# Altium schematic sheet k26_baseboard_dp.SchDoc: k26 Baseboard Displayport
size A4; DrawnBy: Ch. Vogt; Organization: PBL; DocumentNumber: 1; Revision: r5; SheetNumber: 12
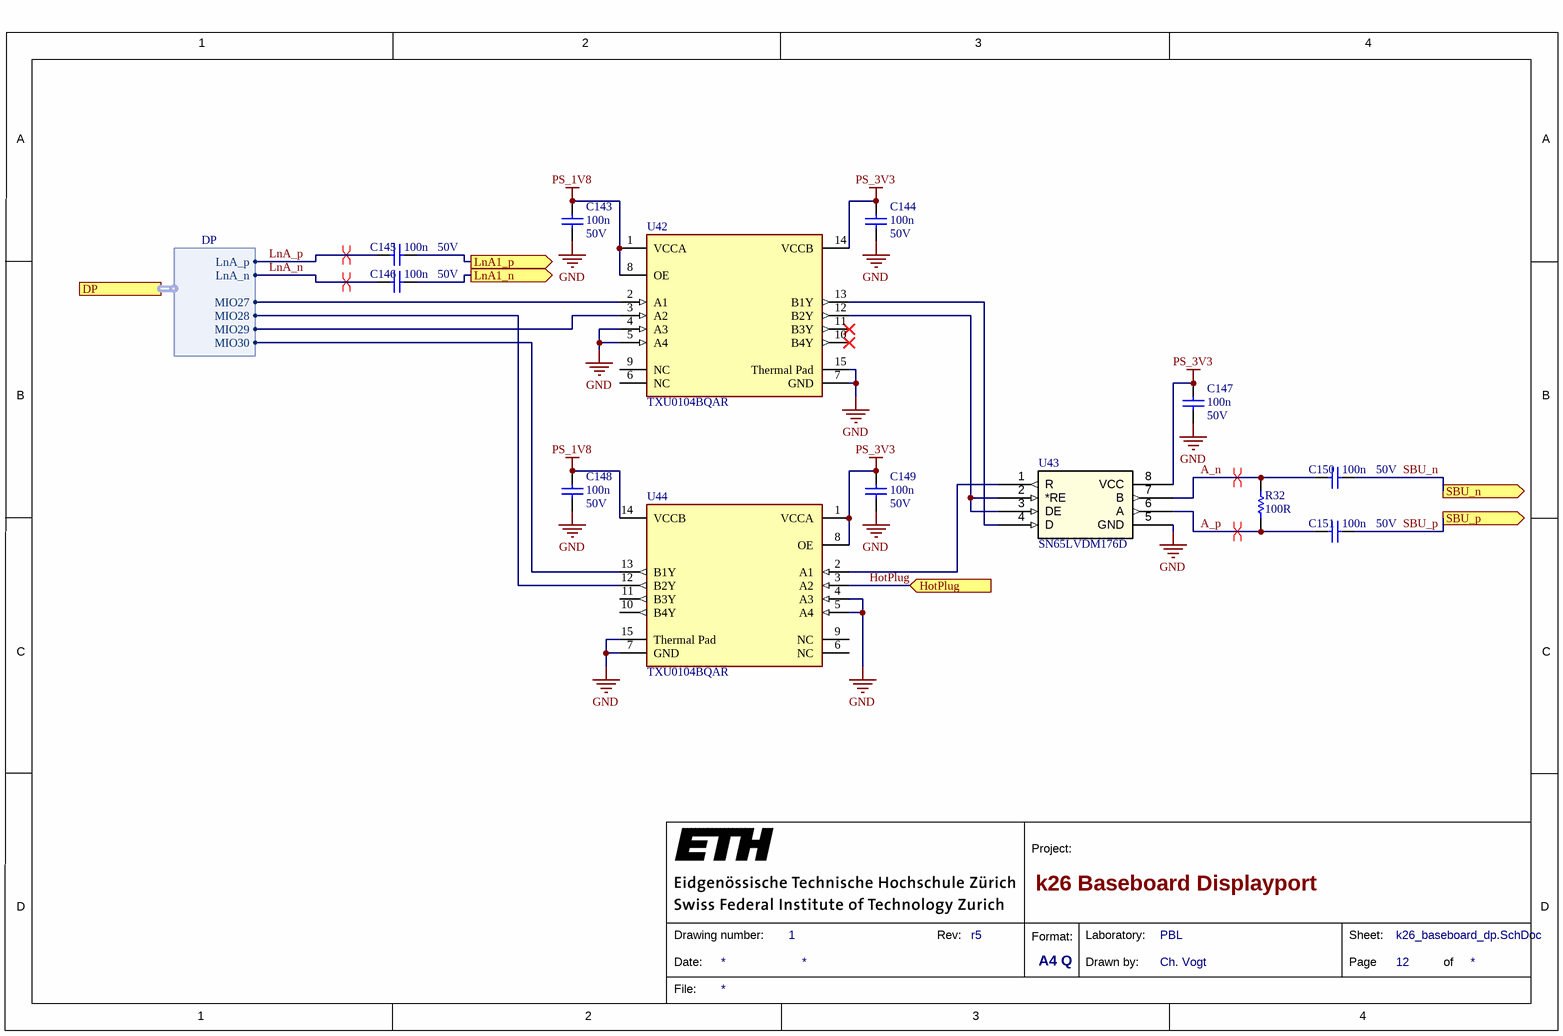
[diagram p0: k26_baseboard_dp.SchDoc]

## Parts
C143  100n  Rated DC Voltage (URdc): 50V  [CAPC0402]
C144  100n  Rated DC Voltage (URdc): 50V  [CAPC0402]
C145  100n  Rated DC Voltage (URdc): 50V  [CAPC0402]
C146  100n  Rated DC Voltage (URdc): 50V  [CAPC0402]
C147  100n  Rated DC Voltage (URdc): 50V  [CAPC0402]
C148  100n  Rated DC Voltage (URdc): 50V  [CAPC0402]
C149  100n  Rated DC Voltage (URdc): 50V  [CAPC0402]
C150  100n  Rated DC Voltage (URdc): 50V  [CAPC0402]
C151  100n  Rated DC Voltage (URdc): 50V  [CAPC0402]
R32  100R  [RES0402]
U42  TXU0104BQAR  [FP-BQA0014A-MFG]
U43  SN65LVDM176D  [D8]
U44  TXU0104BQAR  [FP-BQA0014A-MFG]

## Ports
DP (harness DP), HotPlug (in), LnA1_n (out), LnA1_p (out), SBU_n (out), SBU_p (out)

## Harnesses
DP: LnA_p, LnA_n, MIO27, MIO28, MIO29, MIO30

## Nets
GND: C143.1 C144.1 C147.1 C148.1 C149.1 U42.4(A3) U42.5(A4) U42.7(GND) U42.15(Thermal_Pad) U43.5(GND) U44.4(A3) U44.5(A4) U44.7(GND) U44.15(Thermal_Pad)
PS_1V8: C143.2 C148.2 U42.1(VCCA) U42.8(OE) U44.14(VCCB)
PS_3V3: C144.2 C147.2 C149.2 U42.14(VCCB) U43.8(VCC) U44.1(VCCA) U44.8(OE)
A_n: C150.2 R32.2 U43.7(B)
A_p: C151.2 R32.1 U43.6(A)
HotPlug: U44.3(A2) ; port HotPlug
LnA1_n: C146.1 ; port LnA1_n
LnA1_p: C145.1 ; port LnA1_p
LnA_n: C146.2 ; port DP.LnA_n
LnA_p: C145.2 ; port DP.LnA_p
SBU_n: C150.1 ; port SBU_n
SBU_p: C151.1 ; port SBU_p
NetU42_2: U42.2(A1) ; port DP.MIO27
NetU42_3: U42.3(A2) ; port DP.MIO29
NetU42_12: U42.12(B2Y) U43.2(*RE) U43.3(DE)
NetU42_13: U42.13(B1Y) U43.4(D)
NetU43_1: U43.1(R) U44.2(A1)
NetU44_12: U44.12(B2Y) ; port DP.MIO28
NetU44_13: U44.13(B1Y) ; port DP.MIO30

Not connected (* = marked no-connect by the designer): U42 6(NC) 9(NC) 10(B4Y)* 11(B3Y)*; U44 6(NC) 9(NC) 10(B4Y) 11(B3Y)

## Layout directives
differential pair: A_n, A_p, LnA_n, LnA_p

## Notes on the sheet
- 1
- 2
- 3
- 4
- A
- B
- C
- Project:
- D
- Date:
- Drawing number:
- Rev:
- Format:
- A4 Q
- Drawn by:
- Laboratory:
- Page
- Sheet:
- of
- File:

## Library data of the parts
C143-C151 = cap0402: Ceramic Capacitor, Multilayer, Ceramic, 50V, 10% +Tol, 10% -Tol, X5R, 15% TC, 0.1uF, Surface Mount, 0402; Manufacturer: Yageo; Manufacturer Part Number: CC0402KRX5R9BB104; Capacitance: 100nF; Multilayer: Yes; Supplier 1: Farnell; Supplier Part Number 1: 3366442; RoHS: Yes; Category: Ceramic Capacitors; Stock 1: 180000; Pricing 1: 10000=0.00890, 50000=0.00870 (CHF); Mount: Surface Mount; Number of Pins: 2; Dielectric Material: Ceramic; Package Shape: Rectangular; Size Code: 0402; Terminal Finish: Nickel; Min Operating Temperature: -55°C; Max Operating Temperature: 85°C; JESD-609 Code: e3; Capacitor Type: Ceramic; Negative Tolerance: 10%; Temperature Characteristics Code: X5R; Termination: Wraparound; Positive Tolerance: 10%; Package Style: SMTMeter; Packaging: Tape and Reel; Length: 1mm; Width: 0.5mm; Height: 0.5mm; Reach SVHC Compliant: Yes; RoHS Compliant: Yes; ComponentLink1URL: https://datasheet.ciiva.com:443/pdfs/VipMasterIC/IC/YAGO/YAGO-S-A0006851646/YAGO-S-A0006851646-1.pdf?src-supplier=IHS+Markit; ComponentLink1Description: https://datasheet.ciiva.com:443/pdfs/VipMasterIC/IC/YAGO/YAGO-S-A0006851646/YAGO-S-A0006851646-1.pdf?src-supplier=IHS+Markit; ComponentLink2URL: http://www.yageo.com/documents/recent/UPY-GPHC_X5R_4V-to-50V_25.pdf?src-supplier=Digi-Key; ComponentLink2Description: http://www.yageo.com/documents/recent/UPY-GPHC_X5R_4V-to-50V_25.pdf?src-supplier=Digi-Key; ComponentLink3URL: http://www.yageo.com/documents/recent/UPY-GPHC_X5R_4V-to-50V_23.pdf?src-supplier=Digi-Key; ComponentLink3Description: http://www.yageo.com/documents/recent/UPY-GPHC_X5R_4V-to-50V_23.pdf?src-supplier=Digi-Key
R32 = res0402: Fixed Resistor, Metal Glaze/thick Film, 0.1W, 100ohm, 50V, 1% +/-Tol, 100ppm/Cel, Surface Mount, 0402; Manufacturer: Panasonic; Manufacturer Part Number: ERJ-2RKF1000X; Power: 100mW; Temperature Coefficient: 100ppm/°C; Rated Temperature: 70°C; Package Height: 0.35mm; Package Length: 1mm; Package Width: 0.5mm; Reference Standard: AEC-Q200; Supplier: Mouser; Supplier Part Number: 667-ERJ-2RKF1000X; RoHS: Yes; Category: Chip SMD Resistors; Stock: 10340868; Pricing: 1=0.1, 10=0.016, 50=0.016, 100=0.009, 1000=0.006, 10000=0.004 (USD); Mounting Technology: Surface Mount; Pins: 2; Case/Package: 0402; Package Shape: Rectangular; Terminal Finish: Nickel; Min Operating Temperature: -55°C; Max Operating Temperature: 155°C; Tolerance: 1%; Resistor Type: FIXED RESISTOR; Packaging: Tape and Reel; Value: 100R; Technology: METAL GLAZE/THICK FILM; Termination: Wraparound; Working Voltage: 50V; Construction: Rectangular; Package Style: SMTMeter; JESD-609 Code: e3; RoHS Compliant: Yes; Reach SVHC Compliant: Yes; ComponentLink1URL: https://datasheet.ciiva.com:443/pdfs/VipMasterIC/IC/PANA/PANA-S-A0009889626/PANA-S-A0009889626-1.pdf?src-supplier=IHS+Markit; ComponentLink1Description: https://datasheet.ciiva.com:443/pdfs/VipMasterIC/IC/PANA/PANA-S-A0009889626/PANA-S-A0009889626-1.pdf?src-supplier=IHS+Markit
U42 U44 = CMP-04899-000128-1: FOUR CHANNEL UNIDIRECTIONAL LEVE; Manufacturer: Texas Instruments; Manufacturer Part Number: TXU0104BQAR
U43 = SN65LVDM176D: No Description Available; Mfr_Name: Texas Instruments; Copyright: Copyright (C) 2023 Ultra Librarian. All rights reserved.; Manufacturer_Part_Number: SN65LVDM176D; Digi-Key_Part_Number_1: 296-1418-5-ND; RefDes: RefDes; Type: DEV